# Altium schematic sheet Other_funtions.SchDoc
size 594 x 420 mm
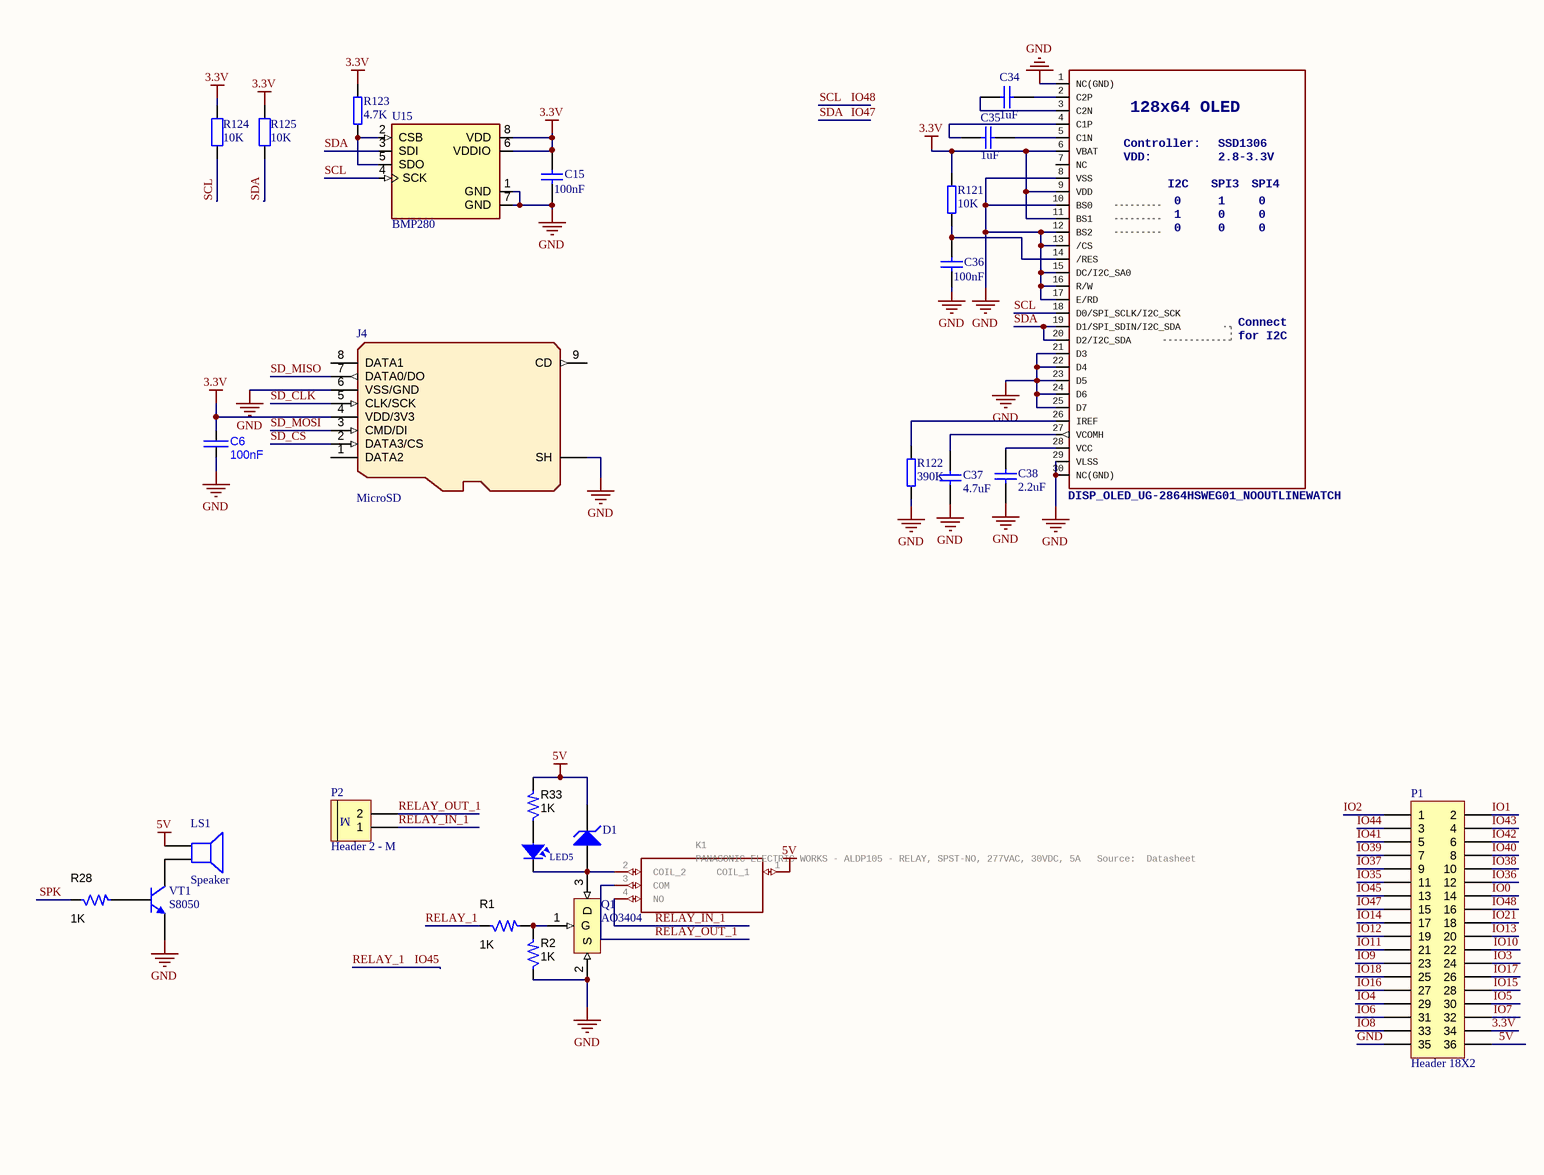
[diagram p0: Other_funtions.SchDoc, left]
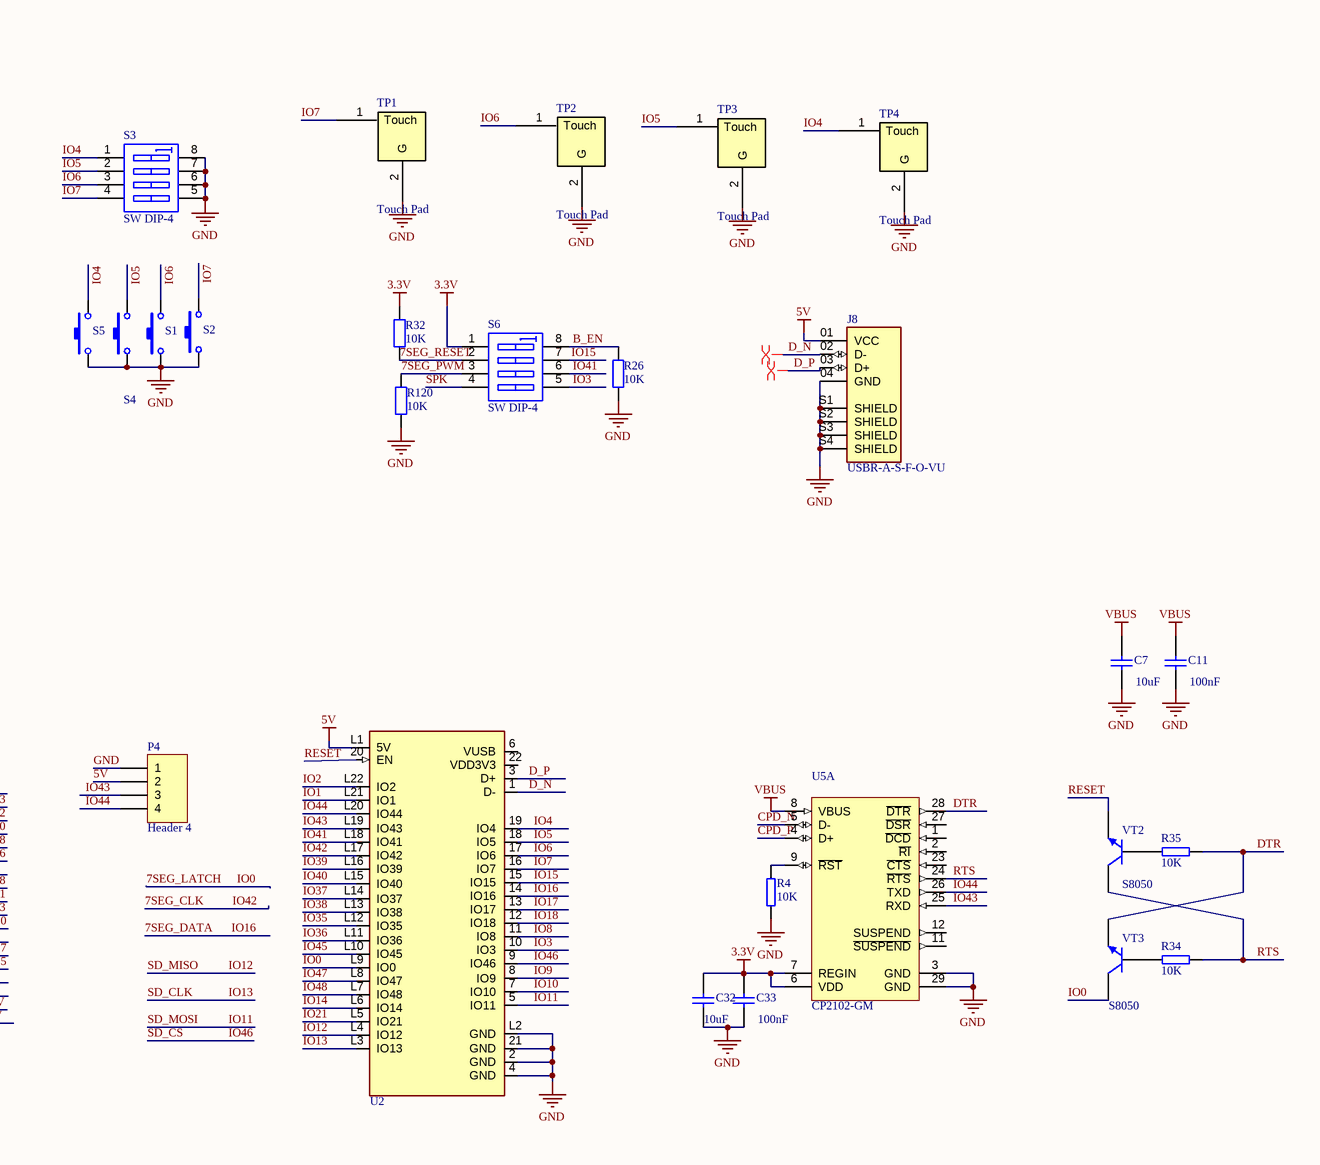
[diagram p1: Other_funtions.SchDoc, right]

## Parts
C6  value 100nF  [CAPC2012X135N]  (hidden comment: approved sub OK)
C7  value 10uF  [CAPC1608X90N]  (hidden comment: Cap Semi)
C11  value 100nF  [CAPC1608X90N]  (hidden comment: Cap Semi)
C15  value 100nF  [CAPC1608X90N]  (hidden comment: Cap Semi)
C32  value 10uF  [CAPC1608X90N]  (hidden comment: Cap Semi)
C33  value 100nF  [CAPC1608X90N]  (hidden comment: Cap Semi)
C34  value 1uF  [CAPC1608X90N]  (hidden comment: Cap Semi)
C35  value 1uF  [CAPC1608X90N]  (hidden comment: Cap Semi)
C36  value 100nF  [CAPC1608X90N]  (hidden comment: Cap Semi)
C37  value 4.7uF  [CAPC1608X90N]  (hidden comment: Cap Semi)
C38  value 2.2uF  [CAPC1608X90N]  (hidden comment: Cap Semi)
D1  Diode Zener  [DIODE/NOM/0.5A]  (value not drawn)
J4  MicroSD  [SDCard_Micro]
J8  USBR-A-S-F-O-VU  [SAMTEC_USBR-A-S-F-O-VU]
K1  PANASONIC ELECTRIC WORKS - ALDP105 - RELAY, SPST-NO, 277VAC, 30VDC, 5A   Source:  Datasheet  [ALDP]
LED5  LED SMD  [SM-LED-0805-Orange]  (value not drawn)
LS1  Speaker  [SPEAKER]
OLED1  DISP_OLED_UG-2864HSWEG01_NOOUTLINEWATCH  128x64OLED: 128x64 OLED  forI2C: for I2C  Controller: Controller:  VDD: VDD:  [UG-2864HSWEG01_1.3]
P1  Header 18X2  [HDR2X18]
P2  Header 2 - M  [Medium - Header 2]
P4  Header 4  [HDR1X4]
Q1  AO3404  [SOT23-3]
R1  1K  [RESC1608N_ZERO]
R2  1K  [RESC1608N_ZERO]
R4  value 10K  [RESC1608N_ZERO]  (hidden comment: Resistor)
R26  value 10K  [RES-0603]  (hidden comment: Res2)
R28  1K  [RESC1608N_ZERO]
R32  value 10K  [RES-0603]  (hidden comment: Res2)
R33  1K  [RESC1608N_ZERO]
R34  value 10K  [RESC1608N_ZERO]  (hidden comment: Resistor)
R35  value 10K  [RESC1608N_ZERO]  (hidden comment: Resistor)
R120  value 10K  [RES-0603]  (hidden comment: Res2)
R121  value 10K  [RESC1608N_ZERO]  (hidden comment: Resistor)
R122  value 390K  [RESC1608N_ZERO]  (hidden comment: Resistor)
R123  value 4.7K  [RESC1608N_ZERO]  (hidden comment: Resistor)
R124  value 10K  [RES-0603]  (hidden comment: Res2)
R125  value 10K  [RES-0603]  (hidden comment: Res2)
S1  SW-SMD  [SW-SMD]  (value not drawn)
S2  SW-SMD  [SW-SMD]  (value not drawn)
S3  SW DIP-4  [DIPSWITCH4]
S4  SW-SMD  [SW-SMD]  (value not drawn)
S5  SW-SMD  [SW-SMD]  (value not drawn)
S6  SW DIP-4  [DIPSWITCH4]
TP1  Touch Pad  [Touch Pad]
TP2  Touch Pad  [Touch Pad]
TP3  Touch Pad  [Touch Pad]
TP4  Touch Pad  [Touch Pad]
U2  ESP32S3_CONTROLLER  [ESP32S3_controller]  (value not drawn)
U5  CP2102-GM  [CP2102]  (part A of 2)
U15  BMP280  [XDCR_BMP280]
VT1  S8050  [SMT_TRIODE_NPN]
VT2  S8050  [SMT_TRIODE_NPN]
VT3  S8050  [SMT_TRIODE_NPN]

## Nets
3.3V: C6.2 C15.2 C32.2 C33.2 J4.4(VDD/3V3) OLED1.6(VBAT) OLED1.9(VDD) OLED1.11(BS1) P1.34 R32.1 R121.1 R123.2 R124.1 R125.1 S6.1(A1) U5.6(VDD) U5.7(REGIN) U15.6(VDDIO) U15.8(VDD)
5V: D1.2(K) J8.01(VCC) K1.1(COIL_1) LS1.1 P1.36 P4.2 R33.2 U2.L1(5V)
GND: C6.1 C7.1 C11.1 C15.1 C32.1 C33.1 C36.1 C37.2 C38.2 J4.6(VSS/GND) J4.SH J8.04(GND) J8.S1(SHIELD) J8.S2(SHIELD) J8.S3(SHIELD) J8.S4(SHIELD) OLED1.1(NC(GND)) OLED1.8(VSS) OLED1.10(BS0) OLED1.12(BS2) OLED1.13(/CS) OLED1.15(DC/I2C_SA0) OLED1.16(R/W) OLED1.17(E/RD) OLED1.21(D3) OLED1.22(D4) OLED1.23(D5) OLED1.24(D6) OLED1.25(D7) OLED1.29(VLSS) OLED1.30(NC(GND)) P1.35 P4.1 Q1.2(S) R2.1 R4.2 R26.2 R120.2 R122.2 S1.1 S2.1 S3.5(B4) S3.6(B3) S3.7(B2) S3.8(B1) S4.1 S5.1 TP1.2(G) TP2.2(G) TP3.2(G) TP4.2(G) U2.2(GND) U2.4(GND) U2.21(GND) U2.L2(GND) U5.3(GND) U5.29(GND) U15.1(GND) U15.7(GND) VT1.2(E)
VBUS: C7.2 C11.2 U5.8(VBUS)
7SEG_CLK: P1.6 U2.L17(IO42)  [also labelled IO42]
7SEG_DATA: P1.27 U2.14(IO16)  [also labelled IO16]
7SEG_LATCH: P1.14 U2.L9(IO0) VT3.3(C)  [also labelled IO0]
7SEG_PWM: R120.1 S6.3(A3)
7SEG_RESET: R32.2 S6.2(A2)
B_EN: R26.1 S6.8(B1)
CPD_N: U5.5(D-)
CPD_P: U5.4(D+)
D_N: J8.02(D-) U2.1(D-)
D_P: J8.03(D+) U2.3(D+)
DTR: R35.2 U5.28(~{DTR}) VT3.2(E)
IO1: P1.2 U2.L21(IO1)
IO2: P1.1 U2.L22(IO2)
IO3: P1.24 S6.5(B4) U2.10(IO3)
IO4: P1.29 S3.1(A1) S5.2 TP4.1(Touch) U2.19(IO4)
IO5: P1.30 S3.2(A2) S4.2 TP3.1(Touch) U2.18(IO5)
IO6: P1.31 S1.2 S3.3(A3) TP2.1(Touch) U2.17(IO6)
IO7: P1.32 S2.2 S3.4(A4) TP1.1(Touch) U2.16(IO7)
IO8: P1.33 U2.11(IO8)
IO9: P1.23 U2.8(IO9)
IO10: P1.22 U2.7(IO10)
IO11: J4.3(CMD/DI) P1.21 U2.5(IO11)  [also labelled SD_MOSI]
IO12: J4.7(DATA0/DO) P1.19 U2.L4(IO12)  [also labelled SD_MISO]
IO13: J4.5(CLK/SCK) P1.20 U2.L3(IO13)  [also labelled SD_CLK]
IO14: P1.17 U2.L6(IO14)
IO15: P1.28 S6.7(B2) U2.15(IO15)
IO17: P1.26 U2.13(IO17)
IO18: P1.25 U2.12(IO18)
IO21: P1.18 U2.L5(IO21)
IO35: P1.11 U2.L12(IO35)
IO36: P1.12 U2.L11(IO36)
IO37: P1.9 U2.L14(IO37)
IO38: P1.10 U2.L13(IO38)
IO39: P1.7 U2.L16(IO39)
IO40: P1.8 U2.L15(IO40)
IO41: P1.5 S6.6(B3) U2.L18(IO41)
IO43: P1.4 P4.3 U2.L19(IO43) U5.25(RXD)
IO44: P1.3 P4.4 U2.L20(IO44) U5.26(TXD)
IO45: P1.13 R1.1 U2.L10(IO45)  [also labelled RELAY_1]
IO46: J4.2(DATA3/CS) U2.9(IO46)  [also labelled SD_CS]
IO47: OLED1.19(D1/SPI_SDIN/I2C_SDA) OLED1.20(D2/I2C_SDA) P1.15 R125.2 U2.L8(IO47) U15.3(SDI)  [also labelled SDA]
IO48: OLED1.18(D0/SPI_SCLK/I2C_SCK) P1.16 R124.2 U2.L7(IO48) U15.4(SCK)  [also labelled SCL]
RELAY_IN_1: K1.4(NO) P2.1
RELAY_OUT_1: K1.3(COM) P2.2
RESET: U2.20(EN) VT2.2(E)
RTS: R34.1 U5.24(~{RTS}) VT2.3(C)
SPK: R28.1 S6.4(A4)
NetC34_1: C34.1 OLED1.2(C2P)
NetC34_2: C34.2 OLED1.3(C2N)
NetC35_1: C35.1 OLED1.5(C1N)
NetC35_2: C35.2 OLED1.4(C1P)
NetC36_2: C36.2 OLED1.14(/RES) R121.2
NetC37_1: C37.1 OLED1.27(VCOMH)
NetC38_1: C38.1 OLED1.28(VCC)
NetD1_1: D1.1(A) K1.2(COIL_2) LED5.2 Q1.3(D)
NetLED5_1: LED5.1 R33.1
NetLS1_2: LS1.2 VT1.3(C)
NetOLED1_26: OLED1.26(IREF) R122.1
NetQ1_1: Q1.1(G) R1.2 R2.2
NetR4_1: R4.1 U5.9(~{RST})
NetR28_2: R28.2 VT1.1(B)
NetR34_2: R34.2 VT3.1(B)
NetR35_1: R35.1 VT2.1(B)
NetR123_1: R123.1 U15.2(CSB) U15.5(SDO)

Not connected (* = marked no-connect by the designer): J4 1(DATA2) 8(DATA1) 9(CD); OLED1 7(NC); U2 6(VUSB) 22(VDD3V3); U5 1(~{DCD}) 2(~{RI}) 11(~{SUSPEND}) 12(SUSPEND) 23(~{CTS}) 27(~{DSR})

## Layout directives
differential pair: D_N, D_P

## Notes on the sheet
- DWG NO:
- REV:
- THIS DOCUMENT AND THE DATA DISCLOSED HEREIN OR
- HEREWITH IS THE PROPERTY OF ALTIUM LIMITED AND MAY
- BE FREELY DISTRIBUTED IN WHOLE. NO RIGHTS ARE
- RESERVED OR EXPRESS OR IMPLIED WARANTEE GIVEN.
- REVISION
- DESCRIPTION
- DATE
- APPROVED
- ENG:
- APPROVALS
- PROJECT
- DSN:
- CHK:
- REFERENCE DOCUMENTS
- PROJECT REVISION:
- TITLE
- DOCUMENT REVISION:
- DESIGN ITEM:
- BOM:
- FAB DWG:
- PCB DWG:
- ASSY DWG:
- SCALE:
- A2
- SIZE
- CAGE CODE
- FILE NAME
- DWG NO.
- SHEET
- OF
- REV
- (in symbol Header 2 - M) M

## Library data of the parts
C6 = CAP C_0805: Capacitor SMD Cer 1.8nF 10% 50V X7R 0805; Manufacturer 1: AVX Corporation; Manufacturer Part Number 1: 08055C182KAT2A; Ratings: 50V; X7R; SCDType: source*; Tolerance: ±10%; Operating Temperature: -55°C ~ 125°C; Package / Case: 0805 (2012 metric); Supplier 1: Digi-Key; Supplier Part Number 1: 478-1374-1-ND
C7 C32 = CAP-SM-0603-X5R-10uF: CAP SM 0603 X5R 10uF 10%; Tolerance: ±10%; Supplier 1: Farnell; Supplier 2: Digi-Key; Supplier Part Number 1: 2366833; Supplier Part Number 2: 490-3896-1-ND
C11 C15 C33-C38 = CAP-SM-0603-X7R-100nF: CAP SM 0603 X7R 100nF 10%; Tolerance: ±10%; Supplier 1: Digi-Key; Supplier 2: Farnell; Supplier Part Number 1: 490-3167-1-ND; Supplier Part Number 2: 1775994RL
D1 = Diode Zener: Zener Diode; Published: 8-Jun-2000; LatestRevisionDate: 17-Jul-2002; LatestRevisionNote: Re-released for DXP Platform.; PackageReference: DIODE-0.7; Publisher: Altium Limited
J4 = MicroSD: Micro SD Memory Card Connector; Value: MicroSD
J8 = USBR-A-S-F-O-VU: USB-A (USB TYPE-A) USB 2.0 Receptacle Connector 4 Position Through Hole; MF: Samtec; SnapEDA_Link: https://www.snapeda.com/parts/USBR-A-S-F-O-VU/Samtec+Inc./view-part/?ref=snap; Package: None; Value: *; MP: USBR-A-S-F-O-VU; Check_prices: https://www.snapeda.com/parts/USBR-A-S-F-O-VU/Samtec+Inc./view-part/?ref=eda
K1 = ALDP105: GateName_1: G$1; SymbolName_1: ALDP105; LibraryName: ALDP105; DeviceSetName: ALDP105; Package: ALDP; Manufacturer_Name: Panasonic; Manufacturer_Part_Number: ALDP105; Mouser_Part_Number: 769-ALDP105; Mouser_Price-Stock: https://www.mouser.co.uk/ProductDetail/Panasonic-Industrial-Devices/ALDP105?qs=Xhpf1s68vbq5B68QcwMLFg%3D%3D; Arrow_Part_Number: ALDP105; Arrow_Price-Stock: https://www.arrow.com/en/products/aldp105/panasonic; Height: mm
LED5 = LED SMD 0805
LS1 = Speaker: Loudspeaker; Published: 24-Mar-1999; LatestRevisionDate: 17-Jul-2002; LatestRevisionNote: Re-released for DXP Platform.; PackageReference: PIN2; Publisher: Altium Limited
P1 = Header 18X2: Header, 18-Pin, Dual row; LatestRevisionDate: 17-Jul-2002; LatestRevisionNote: Re-released for DXP Platform.; Publisher: Altium Limited
P2 = Header 2 - M: Header, 2-Pin, Medium; LatestRevisionDate: 17-Jul-2002; LatestRevisionNote: Re-released for DXP Platform.; Publisher: Altium Limited
P4 = Header 4: Header, 4-Pin; LatestRevisionDate: 17-Jul-2002; LatestRevisionNote: Re-released for DXP Platform.; Publisher: Altium Limited
R1 R2 R28 R33 = RES_0603: Resistor SMD chip 0.0 Ohm 0.1W 0603; Manufacturer 1: Vishay/Dale; Manufacturer Part Number 1: CRCW06030000Z0EA; Tolerance: ±5%; Ratings: 1/10W; SCDType: spec; Package / Case: 0603 (1608metric); Supplier 1: Digi-Key; Supplier Part Number 1: 541-0.0GCT-ND; ComponentLink1URL: http://www.vishay.com/doc?20035; ComponentLink1Description: http://www.vishay.com/doc?20035; Supplier 2: Digi-Key; Supplier Part Number 2: P0.0GTR-ND; Manufacturer 2: Panasonic Electronic Components; Manufacturer Part Number 2: ERJ-3GEY0R00V; RoHS 2: RoHS Compliant; ComponentLink2URL: http://industrial.panasonic.com/www-cgi/jvcr13pz.cgi?E+PZ+3+AOA0001+ERJ3GEY0R00V+7+WW; ComponentLink2Description: http://industrial.panasonic.com/www-cgi/jvcr13pz.cgi?E+PZ+3+AOA0001+ERJ3GEY0R00V+7+WW; Supplier 3: Digi-Key; Supplier Part Number 3: 311-0.0LECT-ND; Manufacturer 3: Yageo; Manufacturer Part Number 3: AC0603JR-070RL; RoHS 3: RoHS Compliant; ComponentLink3URL: http://www.yageo.com/documents/recent/PYu-AC_51_RoHS_L_2.pdf; ComponentLink3Description: http://www.yageo.com/documents/recent/PYu-AC_51_RoHS_L_2.pdf
R4 R34 R35 R121-R123 = RES-SM-0603-10K: RES SM 0603 10K; Supplier 1: Farnell; Supplier 2: Digi-Key; Supplier Part Number 1: 9330399; Supplier Part Number 2: 541-10.0KHCT-ND
R26 R32 R120 R124 R125 = Res2: Resistor; Published: 8-Jun-2000; LatestRevisionDate: 17-Jul-2002; LatestRevisionNote: Re-released for DXP Platform.; PackageReference: AXIAL-0.4; Publisher: Altium Limited; PackageDescription: Axial Device, Thru-Hole; 2 Leads; 0.4 in Pin Spacing
S1 S2 S4 S5 = SW-SMD: Switch; Published: 24-Mar-1999; LatestRevisionDate: 17-Jul-2002; LatestRevisionNote: Re-released for DXP Platform.; PackageReference: SPST-2; Publisher: Altium Limited
S3 S6 = SW DIP-4: DIP Switch, 4 Position, SPST; Published: 24-Mar-1999; LatestRevisionDate: 29-May-2009; LatestRevisionNote: IPC-7351 Footprint Added.; PackageVersion: Dec-2002; PackageReference: SO8; Publisher: Altium Limited; PackageDescription: 8-Pin Small Outline Integrated Circuit 1.27 mm Pitch; Code_JEDEC: MS-012-AA; Code_IPC: SOIC127P600-8
U5 = CP2102-GM: Single-Chip USB to UART Bridge, 1024 Bytes EEPROM, -40 to 85 degC, 28-pin QFN, Tube; Manufacturer: Silicon Labs; Internal Oscillator: TRUE; Sub-Family: USB Bridges; DatasheetVersion: Rev. 1.5; PackageReference: QFN-28; PackageDescription: 28-Pin Quad-Flat No-Leads Package, Body 5 x 5 mm, Pitch 0.5 mm; Supplier 1: Digi-Key; Supplier Part Number 1: 336-1160-5-ND; Supplier 2: Farnell; Supplier Part Number 2: 9282130; Supplier 3: Newark; Supplier Part Number 3: 30K5635; Supplier 4: Mouser; Supplier Part Number 4: 634-CP2102-GM; EEPROM: 1024 Bytes; Mounting Technology: Surface Mount; Code_JEDEC: MO-220; Code_IPC: J-STD-020C; PartNumber: CP2102-GM; ComponentLink1Description: Manufacturer URL; ComponentLink1URL: http://www.silabs.com/; ComponentLink2Description: Datasheet; ComponentLink2URL: http://www.silabs.com/Support%20Documents/TechnicalDocs/CP2102-9.pdf; ComponentLink3Description: Package Specification; ComponentLink3URL: http://www.silabs.com/Support%20Documents/TechnicalDocs/C8051T61x.pdf
U15 = BMP280: BMP280 Absolute Barometric Pressure Sensor for Battery Powered Devices 2 x 2.5mm; Package: None; Availability: Unavailable; MP: BMP280; Value: *; Price: None
VT1-VT3 = SMT_TRIODE_NPN: Surface mount NPN transistor, package SOT-23
OLED1 = DISP_OLED_UG-2864HSWEG01_NOOUTLINEWATCH: I2C: I2C; SPI3: SPI3; 0: 0; 1: 1; Connect: Connect; SSD1306: SSD1306; 2.8-3.3V: 2.8-3.3V; SPI4: SPI4